# Altium project Smart-Plane.PrjPcb
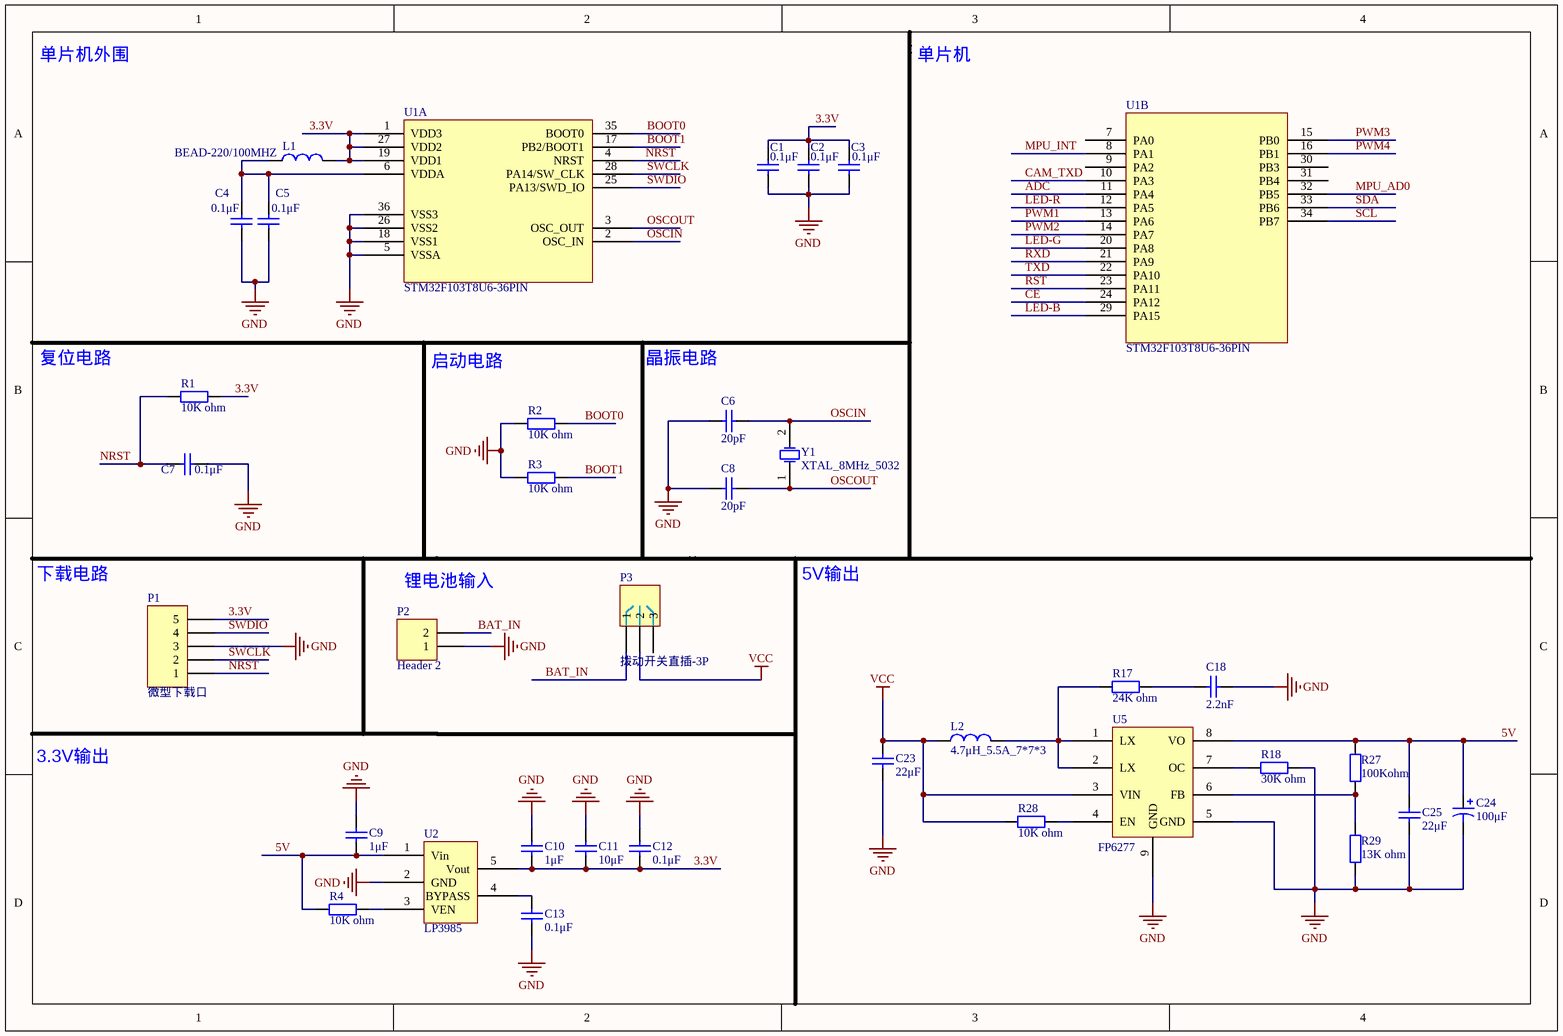
[diagram p0: MCU.SchDoc]
2 sheets, 75 parts. Net scope: global (net labels, ports and power ports of the same name join across sheets).
Board file: Smart-Plane.PcbDoc
Sheets:
  MCU.SchDoc
  Module.SchDoc

## Sheet MCU.SchDoc
size A4

### Parts
C1  0.1μF  [0603C]
C2  0.1μF  [0603C]
C3  0.1μF  [0603C]
C4  0.1μF  [0603C]
C5  0.1μF  [0603C]
C6  20pF  [0603C]
C7  0.1μF  [0603C]
C8  20pF  [0603C]
C9  1μF  [0603C]
C10  1μF  [0603C]
C11  10μF  [0603C]
C12  0.1μF  [0603C]
C13  0.1μF  [0603C]
C18  2.2nF  [0603C]
C23  22μF  [1206C]
C24  100μF  [D7343C]
C25  22μF  [1206C]
L1  BEAD-220/100MHZ  [0603R]
L2  4.7μH_5.5A_7*7*3  [7*7*3mm - 06030]
P1  微型下载口  [微型下载口]
P2  Header 2  [HDR1X2]
P3  拨动开关直插-3P  [拨动开关-3P]
R1  10K ohm  [0603R]
R2  10K ohm  [0603R]
R3  10K ohm  [0603R]
R4  10K ohm  [0603R]
R17  24K ohm  [0603R]
R18  30K ohm  [0603R]
R27  100Kohm  [0603R]
R28  10K ohm  [0603R]
R29  13K ohm  [0603R]
U1  STM32F103T8U6-36PIN  [QFN-36N]  (parts A,B of 2)
U2  LP3985  [SOT-23-5]
U5  FP6277  [SO8 - FP6277]
Y1  XTAL_8MHz_5032  [5032]

### Nets
GND: C1.1 C2.1 C3.1 C4.1 C5.1 C6.1 C7.1 C8.1 C9.1 C10.1 C11.2 C12.2 C13.1 C18.1 C23.1 C24.2 C25.1 P1.3 P2.1 R2.1 R3.1 R18.2 R29.1 U1.5(VSSA) U1.18(VSS1) U1.26(VSS2) U1.36(VSS3) U2.2(GND) U5.5(GND) U5.9(GND)
VCC: C23.2 L2.1 P3.2 R28.1 U5.3(VIN)
3.3V: C1.2 C2.2 C3.2 C10.2 C11.1 C12.1 L1.2 P1.5 R1.2 U1.1(VDD3) U1.19(VDD1) U1.27(VDD2) U2.5(Vout)
5V: C9.2 C24.1 C25.2 R4.1 R27.2 U2.1(Vin) U5.8(VO)
ADC: U1.11(PA4)
BAT_IN: P2.2 P3.1
BOOT0: R2.2 U1.35(BOOT0)
BOOT1: R3.2 U1.17(PB2/BOOT1)
CAM_TXD: U1.10(PA3)
CE: U1.24(PA12)
LED-B: U1.29(PA15)
LED-G: U1.20(PA8)
LED-R: U1.12(PA5)
MPU_AD0: U1.32(PB5)
MPU_INT: U1.8(PA1)
NRST: C7.2 P1.1 R1.1 U1.4(NRST)
OSCIN: C6.2 U1.2(OSC_IN) Y1.2(OSC2)
OSCOUT: C8.2 U1.3(OSC_OUT) Y1.1(OSC1)
PWM1: U1.13(PA6)
PWM2: U1.14(PA7)
PWM3: U1.15(PB0)
PWM4: U1.16(PB1)
RST: U1.23(PA11)
RXD: U1.21(PA9)
SCL: U1.34(PB7)
SDA: U1.33(PB6)
SWCLK: P1.2 U1.28(PA14/SW_CLK)
SWDIO: P1.4 U1.25(PA13/SWD_IO)
TXD: U1.22(PA10)
NetC4_2: C4.2 C5.2 L1.1 U1.6(VDDA)
NetC13_2: C13.2 U2.4(BYPASS)
NetC18_2: C18.2 R17.1
NetL2_2: L2.2 R17.2 U5.1(LX) U5.2(LX)
NetR4_2: R4.2 U2.3(VEN)
NetR18_1: R18.1 U5.7(OC)
NetR27_1: R27.1 R29.2 U5.6(FB)
NetR28_2: R28.2 U5.4(EN)

Not connected (* = marked no-connect by the designer): P3 3; U1 7(PA0) 9(PA2) 30(PB3) 31(PB4)

### Notes on the sheet
- 单片机外围
- 单片机
- 复位电路
- 启动电路
- 晶振电路
- 下载电路
- 5V输出
- (near P2) 锂电池输入
- 3.3V输出

### Library data of the parts
C1-C5 C7 C12 C13 = Cap_0.1μF_50V_0603: 0.1μF_50V,X7R,±5%; 物料名称: 贴片陶瓷电容; 制造商: muRata; 物料编码: TCC0087; 物料型号: GRM188R71H104JA93D; 单位: PCS; 物料规格: 0.1μF_50V,X7R,±5%
C6 C8 = Cap_20pF_50V_0603: 20pF_50V,CH,±5%; 物料名称: 贴片陶瓷电容; 制造商: muRata; 物料编码: TCC0036; 物料型号: GRM1882C1H200JA01D; 单位: PCS; 物料规格: 20pF_50V,CH,±5%
C9 C10 = Cap_1μF_50V_0603: 1μF_50V,X5R,±10%; 物料名称: 贴片陶瓷电容; 制造商: muRata; 物料编码: TCC0040; 物料型号: GRM188R61H105KAALD; 单位: PCS; 物料规格: 1μF_50V,X5R,±10%
C11 = Cap_10μF_35V_0603: 10μF_35V,X5R,20%; 物料规格: 10μF_35V,20%; 物料名称: 贴片陶瓷电容; 制造商: muRata; 物料编码: TCC0071; 物料型号: GRM188R6YA106MA73D; 单位: PCS
C18 = Cap_2.2nF_50V_0603: 2.2nF_50V,X7R,10%; 物料名称: 贴片陶瓷电容; 制造商: muRata; 物料编码: NA; 单位: PCS; 物料规格: 2.2nF_50V,X7R,10%; 物料型号: NA
C23 C25 = Cap_22μF_35V_1206: 22μF_35V,20%; 物料名称: 贴片陶瓷电容; 制造商: TDK; 物料编码: NA; 物料型号: C3216JB1V226M160AC; 单位: PCS; 物料规格: 22μF_35V,20%
C24 = Cap_100μF_16V_D7343: 100μF_16V; 物料名称: 钽电容; 制造商: AVX; 物料编码: NA; 单位: PCS; 物料规格: 100μF_16V; 物料型号: NA
L1 = BEAD-220/100MHZ_0603: 物料名称: 磁珠; 制造商: TDK; 物料编码: TCZ0006; 物料型号: MMZ1608B221CTAH0; 单位: PCS; 物料规格: BEAD-220/100MHZ
L2 = 4.7μH_5.5A_7*7*3: 4.7μH_5.5A_; 物料名称: 功率电感; 制造商: 台湾奇力新; 物料编码: NA; 物料型号: MHCC10040-4R7M-R8_06030; 单位: PCS; 物料规格: 4.7μH_5.5A_7*7*3
P1 = 微型下载口: 制造商: NA; 单位: PCS; 物料规格: 微型下载口; 物料名称: 微型下载口; 物料编码: NA; 物料型号: 微型下载口
P2 = Header 2: Header, 2-Pin; LatestRevisionDate: 17-Jul-2002; LatestRevisionNote: Re-released for DXP Platform.; Publisher: Altium Limited
P3 = 拨动开关直插-3P: 制造商: NA; 单位: PCS; 物料规格: 拨动开关直插-3P; 物料名称: 拨动开关直插-3P; 物料编码: NA; 物料型号: 拨动开关直插-3P
R1-R4 R28 = Res_10K ohm_0603: 10K ohm,1%; 物料名称: 贴片电阻; 制造商: YAGEO; 物料编码: TRS0020; 物料型号: RC0603FR-0710KL; 单位: PCS; 物料规格: 10K ohm,1%
R17 = Res_24K ohm_0603: 24K ohm,1%; 物料名称: 贴片电阻; 制造商: YAGEO; 物料编码: NA; 物料型号: RC0603FR-0724KL; 单位: PCS; 物料规格: 24K ohm,1%
R18 = Res_30K ohm_0603: 30K ohm,1%; 物料名称: 贴片电阻; 制造商: YAGEO; 物料编码: TRS0028; 物料型号: RC0603FR-0730KL; 单位: PCS; 物料规格: 30K ohm,1%
R27 = Res_100Kohm_0603: 100K ohm_5%; 物料名称: 贴片电阻; 制造商: YAGEO; 物料编码: TRS0032; 物料型号: RC0603JR-07100K; 单位: PCS; 物料规格: 100K ohm_5%
R29 = Res_13K ohm_0603: 13K ohm,1%; 物料名称: 贴片电阻; 制造商: YAGEO; 单位: PCS; 物料规格: 13K ohm,1%
U1 = STM32F103T8U6-36PIN: 物料名称: 单片机; 单位: PCS; 制造商: ST; 物料编码: NA; 物料型号: STM32F103T8U6-36PIN; 物料规格: STM32F103T8U6-36PIN
U2 = LP3985: 物料名称: 3.3V LDO; 制造商: National Semiconductor; 物料编码: TIC0029; 物料型号: LP3985IM5-3.3/NOPB; 单位: PCS; 物料规格: LP3985
U5 = FP6277: 物料名称: 升压芯片; 制造商: 台湾远翔; 物料编码: NA; 单位: PCS; 物料规格: FP6277; 物料型号: FP6277
Y1 = XTAL_8MHz_5032: XTAL_8MHz; 物料规格: 8MHz; 物料名称: 晶振; 制造商: TAITIEN; 物料编码: NA; 物料型号: XIHCCCNANF-8.000; 单位: PCS

## Sheet Module.SchDoc
size A4
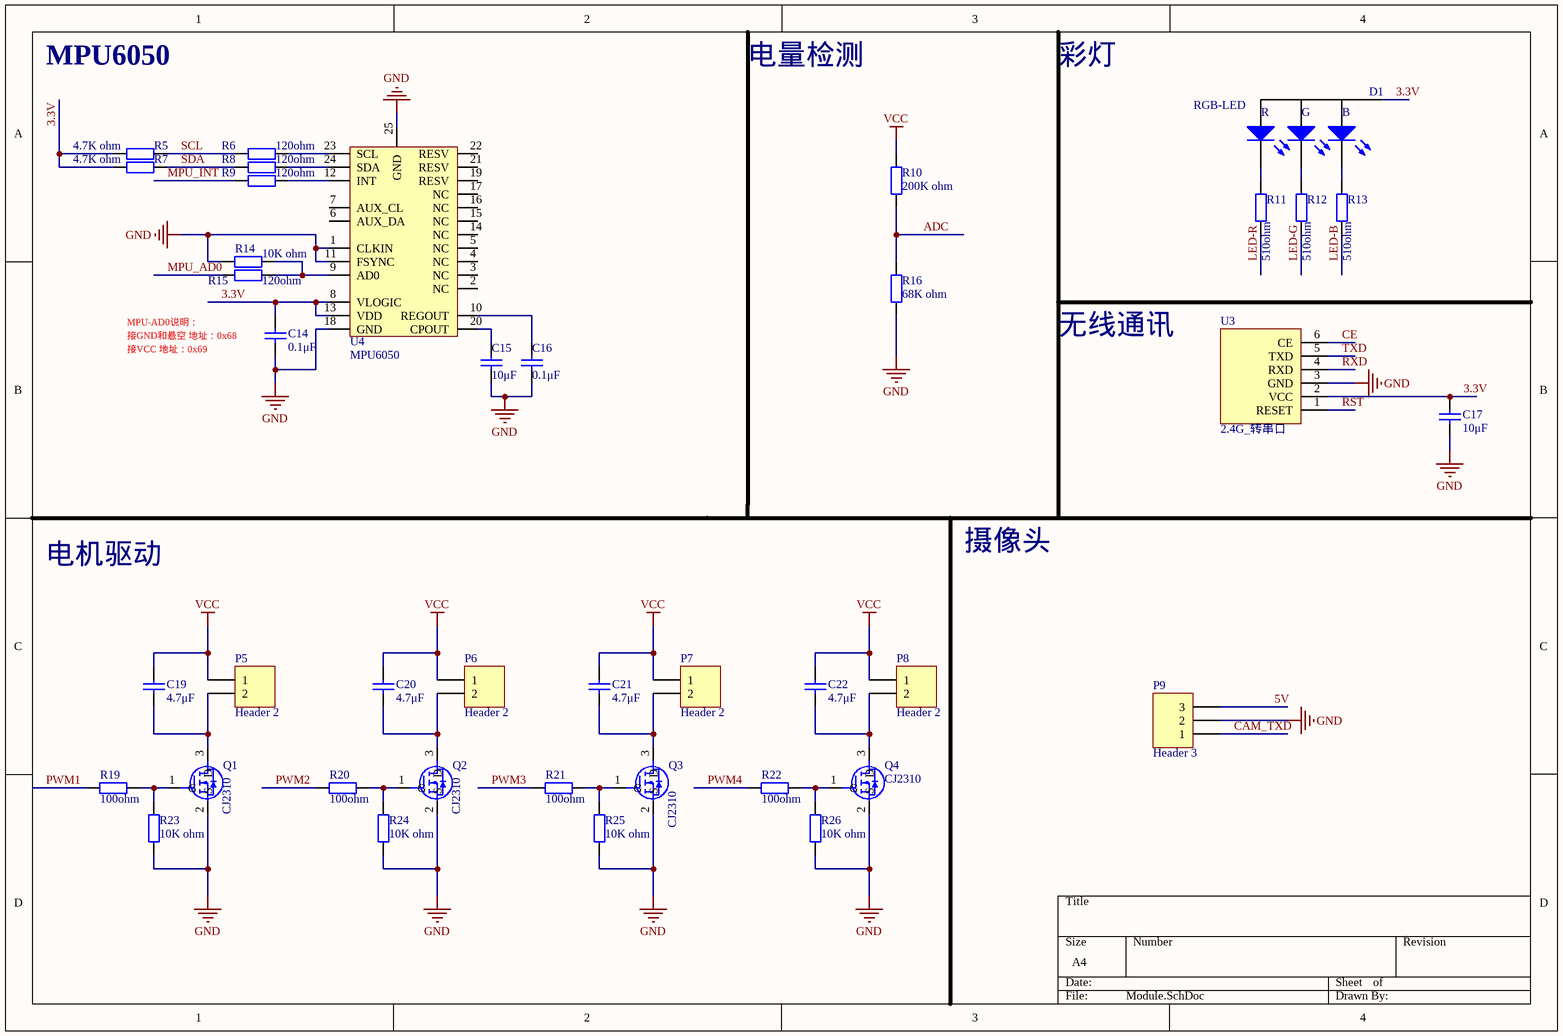
[diagram p1: Module.SchDoc]

### Parts
C14  0.1μF  [0603C]
C15  10μF  [0603C]
C16  0.1μF  [0603C]
C17  10μF  [0603C]
C19  4.7μF  [0603C]
C20  4.7μF  [0603C]
C21  4.7μF  [0603C]
C22  4.7μF  [0603C]
D1  RGB-LED  [RGB-LED]
P5  Header 2  [HDR1X2]
P6  Header 2  [HDR1X2]
P7  Header 2  [HDR1X2]
P8  Header 2  [HDR1X2]
P9  Header 3  [HDR1X3]
Q1  CJ2310  [SOT23-3]
Q2  CJ2310  [SOT23-3]
Q3  CJ2310  [SOT23-3]
Q4  CJ2310  [SOT23-3]
R5  4.7K ohm  [0603R]
R6  120ohm  [0603R]
R7  4.7K ohm  [0603R]
R8  120ohm  [0603R]
R9  120ohm  [0603R]
R10  200K ohm  [0603R]
R11  510ohm  [0603R]
R12  510ohm  [0603R]
R13  510ohm  [0603R]
R14  10K ohm  [0603R]
R15  120ohm  [0603R]
R16  68K ohm  [0603R]
R19  100ohm  [0603R]
R20  100ohm  [0603R]
R21  100ohm  [0603R]
R22  100ohm  [0603R]
R23  10K ohm  [0603R]
R24  10K ohm  [0603R]
R25  10K ohm  [0603R]
R26  10K ohm  [0603R]
U3  2.4G_转串口  [2.4G-串口]
U4  MPU6050  [QFN24]

### Nets
GND: C14.1 C15.1 C16.1 C17.1 P9.2 Q1.2(S) Q2.2(S) Q3.2(S) Q4.2(S) R14.1 R16.1 R23.1 R24.1 R25.1 R26.1 U3.3(GND) U4.1(CLKIN) U4.11(FSYNC) U4.18(GND) U4.25(GND)
VCC: C19.2 C20.2 C21.2 C22.2 P5.1 P6.1 P7.1 P8.1 R10.2
3.3V: C14.2 C17.2 D1.3 R5.1 R7.1 U3.2(VCC) U4.8(VLOGIC) U4.13(VDD)
5V: P9.3
ADC: R10.1 R16.2
CAM_TXD: P9.1
CE: U3.6(CE)
LED-B: R13.1
LED-G: R12.1
LED-R: R11.1
MPU_AD0: R15.1
MPU_INT: R9.1
PWM1: R19.1
PWM2: R20.1
PWM3: R21.1
PWM4: R22.1
RST: U3.1(RESET)
RXD: U3.4(RXD)
SCL: R5.2 R6.1
SDA: R7.2 R8.1
TXD: U3.5(TXD)
NetC15_2: C15.2 U4.20(CPOUT)
NetC16_2: C16.2 U4.10(REGOUT)
NetC19_1: C19.1 P5.2 Q1.3(D)
NetC20_1: C20.1 P6.2 Q2.3(D)
NetC21_1: C21.1 P7.2 Q3.3(D)
NetC22_1: C22.1 P8.2 Q4.3(D)
NetD1_1: D1.1 R13.2
NetD1_2: D1.2 R12.2
NetD1_4: D1.4 R11.2
NetQ1_1: Q1.1(G) R19.2 R23.2
NetQ2_1: Q2.1(G) R20.2 R24.2
NetQ3_1: Q3.1(G) R21.2 R25.2
NetQ4_1: Q4.1(G) R22.2 R26.2
NetR6_2: R6.2 U4.23(SCL)
NetR8_2: R8.2 U4.24(SDA)
NetR9_2: R9.2 U4.12(INT)
NetR14_2: R14.2 R15.2 U4.9(AD0)

Not connected (* = marked no-connect by the designer): U4 2(NC) 3(NC) 4(NC) 5(NC) 6(AUX_DA) 7(AUX_CL) 14(NC) 15(NC) 16(NC) 17(NC) 19(RESV) 21(RESV) 22(RESV)

### Notes on the sheet
- MPU6050
- 电量检测
- 彩灯
- MPU-AD0说明：
- 接GND和悬空 地址：0x68
- 接VCC 地址：0x69
- 无线通讯
- 电机驱动
- 摄像头
- (in symbol RGB-LED) R; G; B

### Library data of the parts
C14 C16 = Cap_0.1μF_50V_0603: as C1 on sheet MCU; 物料规格: 0.1μF_50V,X7R,±5%
C15 C17 = Cap_10μF_35V_0603: as C11 on sheet MCU
C19-C22 = Cap_4.7μF_50V_0603: 4.7μF_50V,±10%; 物料名称: 贴片陶瓷电容; 制造商: TDK; 物料编码: NA; 单位: PCS; 物料规格: 4.7μF_50V,±10%; 物料型号: NA
D1 = RGB-LED: 制造商: 亿光; 物料编码: NA; 物料型号: TLMB1100; 单位: PCS; 物料规格: RGB-LED; 物料名称: RGB-LED
P5-P8 = Header 2: Header, 2-Pin; LatestRevisionDate: 17-Jul-2002; LatestRevisionNote: Re-released for DXP Platform.; Publisher: Altium Limited
P9 = Header 3: Header, 3-Pin; LatestRevisionDate: 17-Jul-2002; LatestRevisionNote: Re-released for DXP Platform.; Publisher: Altium Limited
Q1-Q4 = CJ2310: 物料名称: NMOS; 制造商: JSCJ; 物料编码: NA; 单位: PCS; 物料规格: CJ2310; 物料型号: CJ2310
R5 R7 = Res_4.7K ohm_0603: 4.7K ohm,1%; 物料名称: 贴片电阻; 制造商: YAGEO; 物料型号: AA0603FR-074K7L; 单位: PCS; 物料规格: 4.7K ohm,1%
R6 R8 R9 R15 = Res_120ohm_0603: 120 ohm_5%; 物料名称: 贴片电阻; 制造商: YAGEO; 物料编码: NA; 单位: PCS; 物料规格: 120 ohm_5%; 物料型号: NA
R10 = Res_200K ohm_0603: 200K ohm,1%; 物料名称: 贴片电阻; 制造商: YAGEO; 物料编码: TRS0060; 物料型号: RC0603FR-07200KL; 单位: PCS; 物料规格: 200K ohm,1%
R11-R13 = Res_510ohm_0603: 510 ohm,1%; 物料名称: 贴片电阻; 制造商: YAGEO; 单位: PCS; 物料规格: 510 ohm,1%
R14 R23-R26 = Res_10K ohm_0603: as R1 on sheet MCU; 物料规格: 10K ohm,1%
R16 = Res_68K ohm_0603: 68K ohm,1%; 物料名称: 贴片电阻; 制造商: YAGEO; 物料编码: NA; 物料型号: RC0603FR-0768KL; 单位: PCS; 物料规格: 68K ohm,1%
R19-R22 = Res_100ohm_0603: 100 ohm_5%; 物料名称: 贴片电阻; 制造商: YAGEO; 物料编码: TRS0010; 物料型号: RC0603JR-07100R; 单位: PCS; 物料规格: 100 ohm_5%
U3 = 2.4G_转串口: 制造商: NA; 单位: PCS; 物料规格: 2.4G_转串口; 物料名称: 2.4G_转串口; 物料编码: NA; 物料型号: 2.4G_转串口
U4 = MPU6050: 物料名称: 陀螺仪; 制造商: InvenSense; 物料编码: NA; 单位: PCS; 物料规格: MPU6050; 物料型号: MPU6050

## Nets that join several sheets
GND: MCU (30 pins), Module (20 pins)
VCC: MCU (5 pins), Module (9 pins)
3.3V: MCU (13 pins), Module (8 pins)
5V: MCU (7 pins), Module (P9.3)
ADC: MCU (U1.11), Module (R10.1 R16.2)
CAM_TXD: MCU (U1.10), Module (P9.1)
CE: MCU (U1.24), Module (U3.6)
LED-B: MCU (U1.29), Module (R13.1)
LED-G: MCU (U1.20), Module (R12.1)
LED-R: MCU (U1.12), Module (R11.1)
MPU_AD0: MCU (U1.32), Module (R15.1)
MPU_INT: MCU (U1.8), Module (R9.1)
PWM1: MCU (U1.13), Module (R19.1)
PWM2: MCU (U1.14), Module (R20.1)
PWM3: MCU (U1.15), Module (R21.1)
PWM4: MCU (U1.16), Module (R22.1)
RST: MCU (U1.23), Module (U3.1)
RXD: MCU (U1.21), Module (U3.4)
SCL: MCU (U1.34), Module (R5.2 R6.1)
SDA: MCU (U1.33), Module (R7.2 R8.1)
TXD: MCU (U1.22), Module (U3.5)